# EAGLE design TPS26600 test (EAGLE 9.6.2)
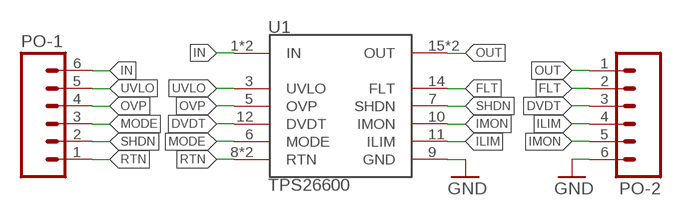
[diagram p0: schematic, sheet 1]

## Parts
PO-1  M06  [1X06]
PO-2  M06  [1X06]
U1  TPS26600  [HTSSOP-16]

## Nets
DVDT: PO-2.3 U1.12(DVDT)
FLT: PO-2.2 U1.14(FLT)
GND: PO-2.6 U1.9(GND)
ILIM: PO-2.4 U1.11(ILIM)
IMON: PO-2.5 U1.10(IMON)
IN: PO-1.6 U1.1(IN) U1.2(IN)
MODE: PO-1.3 U1.6(MODE)
OUT: PO-2.1 U1.15(OUT) U1.16(OUT)
OVP: PO-1.4 U1.5(OVP)
RTN: PO-1.1 U1.8(RTN) U1.PAD(RTN)
SHDN: PO-1.2 U1.7(SHDN)
UVLO: PO-1.5 U1.3(UVLO)

## Library data of the parts
PO-1 PO-2 = HyTechDevices:M06: Standard 6-pin 0.1" header. NOTES ON THE VARIANTS LOCK and LOCK_LONGPADS... This footprint was designed to help hold the alignment of a through-hole component (i.e. 6-pin header) while soldering it into place. You may notice that each hole has been shifted either up or down by 0.005 of an inch from it's more standard position (which is a perfectly straight line). This slight alteration caused the pins (the squares in the middle) to touch the edges of the holes. Because they are alternating, it causes a "brace" to hold the component in place. 0.005 has proven to be the perfect amount of "off-center" position when using our standard breakaway headers. Although looks a little odd when you look at the bare footprint, once you have a header in there, the alteration is very hard to notice. Also,if you push a header all the way into place, it is covered up entirely on the bottom side. This idea of altering the position of holes to aid alignment will be further integrated into the Sparkfun Library for other footprints. It can help hold any component with 3 or more connection pins. Note: The Sparkfun version includes many other packages including surface mount that may be of future interest. Source: Sparkfun <https://github.com/sparkfun/SparkFun-Eagle-Libraries>
U1 = HyTechDevices:TPS26600

## Board
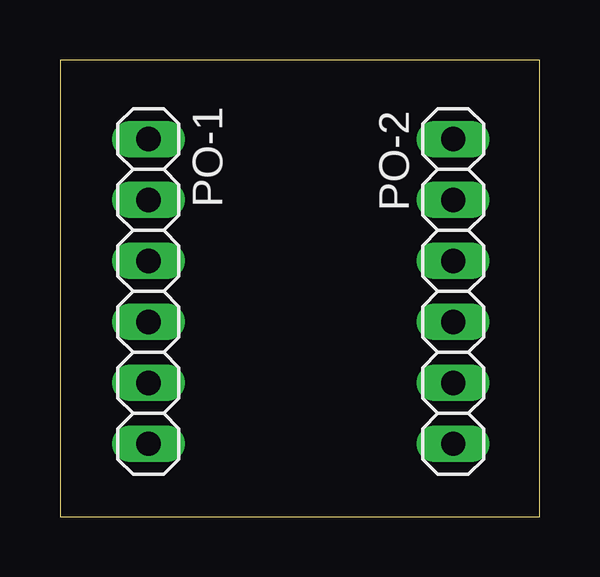
[diagram p1: board, top side]
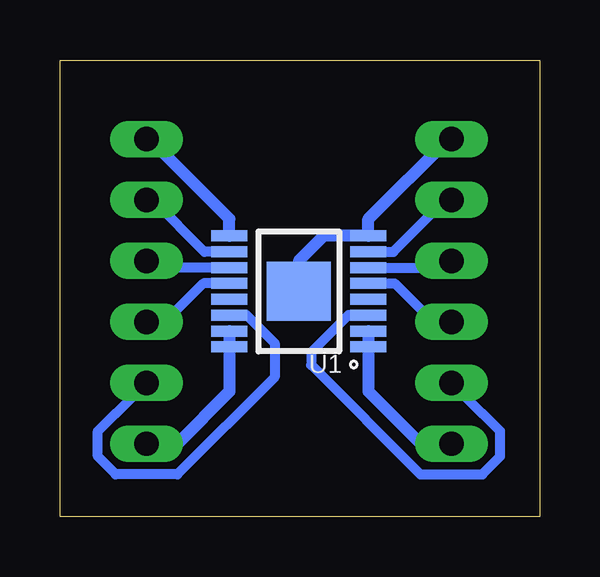
[diagram p2: board, bottom side, seen from below]

Size 19.99 x 19.04 mm. Coordinates in mm from the lower left corner, seen from the top.
Outline: 0,0 19.99,0 19.99,19.04 0,19.04 0,0
Copper layers 16: Bottom 0.035mm
Design rules "On Campus (1 Layer)": minimum track width 16mil, minimum drill 0.8mm, track to track 16mil, track to pad 12mil, pad to pad 16mil, via to via 16mil, smd to smd 10mil, copper to edge 40mil, drill to drill 10mil, minimum pad ring 10mil, minimum via ring 8mil, stop-mask expansion 4mil, vias tented up to drill 0mil, thermal gap 10mil

### Footprints (pad centres in the part's own frame; a part is rotated, then mirrored left to right if it is on the bottom)
1X06 = drill 1.016 long: 1 -6.35,0; 2 -3.81,0; 3 -1.27,0; 4 1.27,0; 5 3.81,0; 6 6.35,0
HTSSOP-16 = smd 1.499 x 0.457: 1 -2.896,2.311; 2 -2.896,1.651; 3 -2.896,0.991; 4 -2.896,0.33; 5 -2.896,-0.33; 6 -2.896,-0.991; 7 -2.896,-1.651; 8 -2.896,-2.311; 9 2.896,-2.311; 10 2.896,-1.651; 11 2.896,-0.991; 12 2.896,-0.33; 13 2.896,0.33; 14 2.896,0.991; 15 2.896,1.651; 16 2.896,2.311 | smd 2.667 x 2.464: PAD 0,0

### Placement (x,y rotation side)
PO-1  3.68,9.4 270 top
PO-2  16.38,9.4 90 top
U1  10.03,9.4 180 bottom

### Tracks (layer width: path | path; a pad name or v marks a point on that pad's centre or on a via)
DVDT
  Bottom 0.406: U1.12 14.02,9.73 15.62,8.13 PO-2.3
FLT
  Bottom 0.406: U1.14 12.22,8.41 11.05,7.24 11.05,5.82 15.1,1.78 17.67,1.78 18.41,2.52 18.41,3.57 17.67,4.32 17.65,4.32 PO-2.2
GND
  Bottom 0.508: U1.9 12.93,12.42 16.26,15.75 PO-2.6
ILIM
  Bottom 0.406: U1.11 16.1,10.39 PO-2.4
IMON
  Bottom 0.406: U1.10 13.97,11.05 16.13,13.21 PO-2.5
IN
  Bottom 0.508: PO-1.6 4.95,3.05 7.14,5.23 U1.1 U1.2
MODE
  Bottom 0.406: U1.6 3.96,10.39 PO-1.3
OUT
  Bottom 0.508: PO-2.1 15.11,3.05 12.93,5.23 U1.16 U1.15
OVP
  Bottom 0.406: U1.5 6.04,9.73 4.45,8.13 PO-1.4
RTN
  Bottom 0.508: PO-1.1 3.81,15.75 7.14,12.42 U1.8 8.99,11.71 10.03,10.67 U1.PAD
SHDN
  Bottom 0.406: U1.7 6.1,11.05 3.94,13.21 PO-1.2
UVLO
  Bottom 0.406: U1.3 7.98,8.41 9.53,6.86 9.53,6.33 4.97,1.78 2.4,1.78 1.65,2.52 1.65,3.57 2.4,4.32 2.41,4.32 PO-1.5